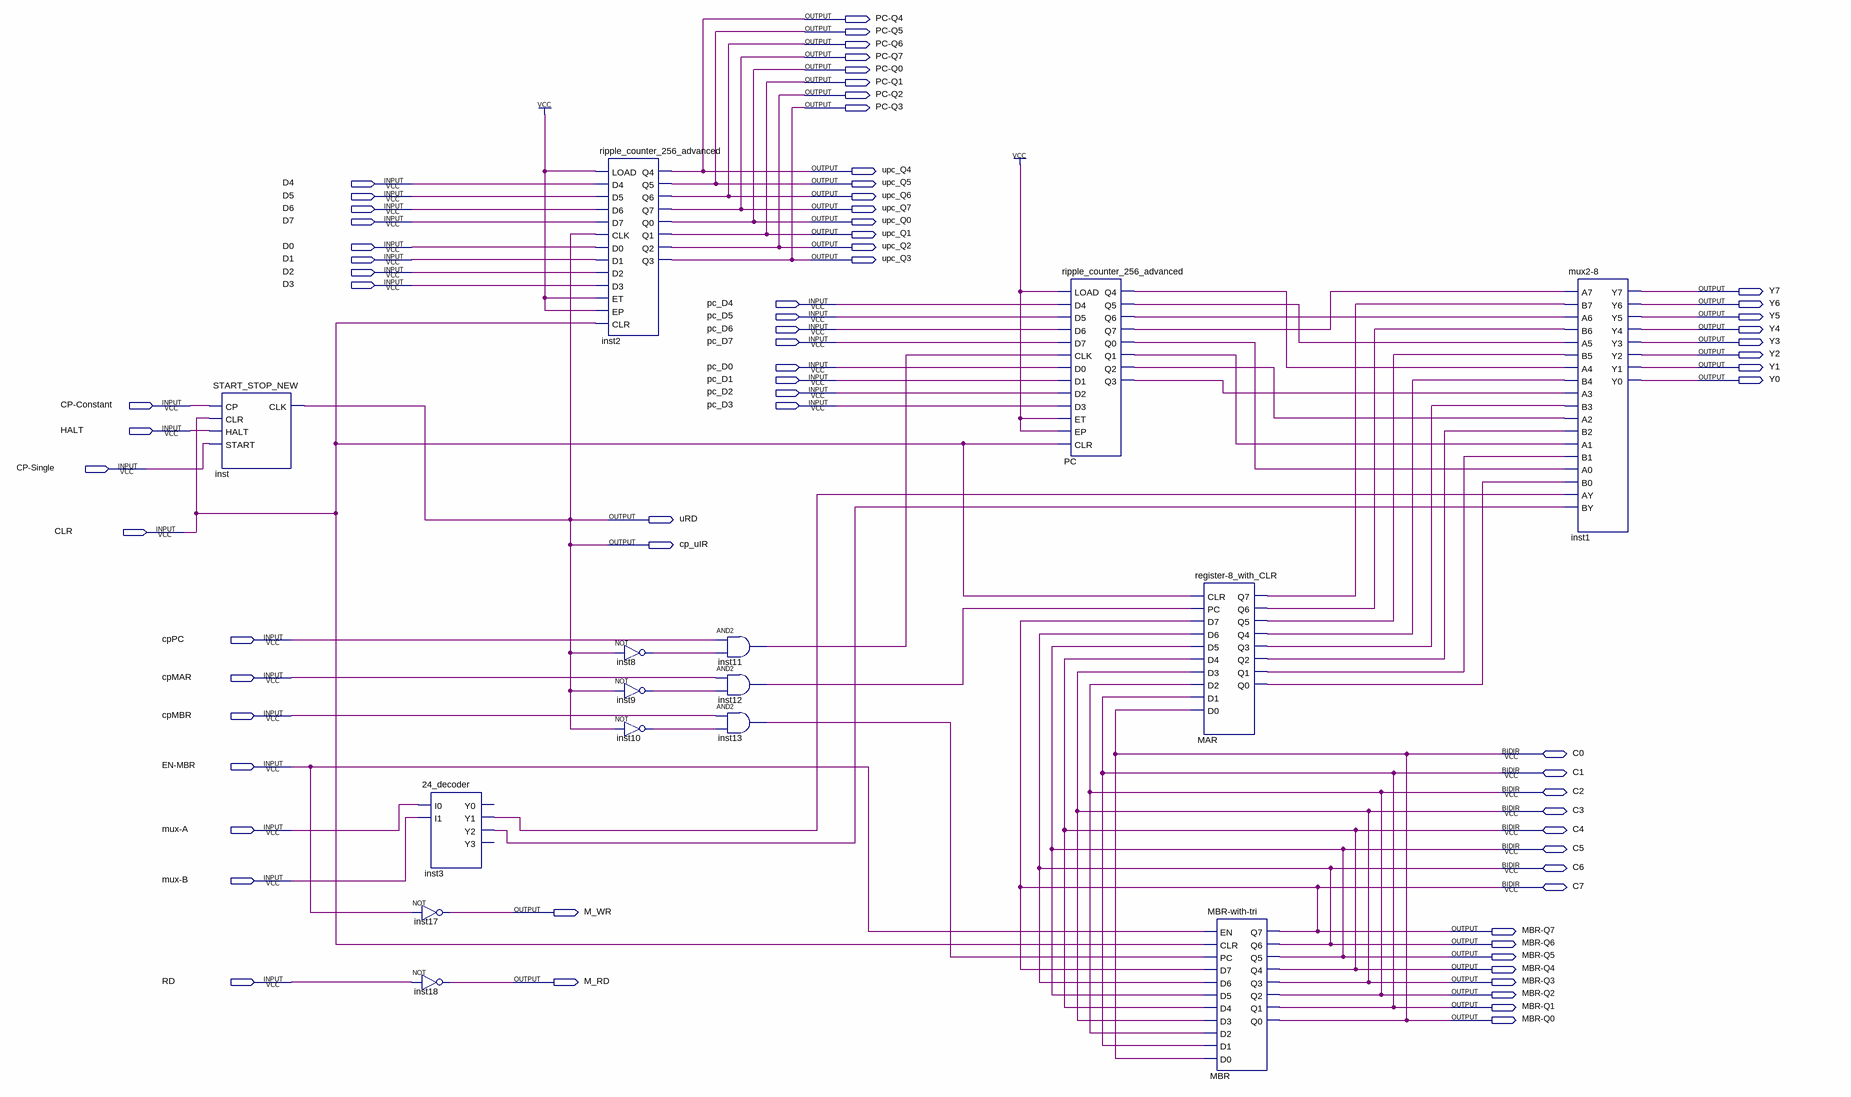
[diagram p0: schematic sheet]
// Quartus schematic microprogram-access.bdf as structural Verilog: 15 symbols, 71 pins
module \microprogram-access  (
  input  D4,
  input  D5,
  input  D6,
  input  D7,
  input  D0,
  input  D1,
  input  D2,
  input  D3,
  input  pc_D4,
  input  pc_D5,
  input  pc_D6,
  input  pc_D7,
  input  pc_D0,
  input  pc_D1,
  input  pc_D2,
  input  \CP-Constant ,
  input  pc_D3,
  input  HALT,
  input  \CP-Single ,
  input  CLR,
  input  cpPC,
  input  cpMAR,
  input  cpMBR,
  input  \EN-MBR ,
  input  \mux-A ,
  input  \mux-B ,
  input  RD,
  inout  C0,
  inout  C1,
  inout  C2,
  inout  C3,
  inout  C4,
  inout  C5,
  inout  C6,
  inout  C7,
  output \PC-Q4 ,
  output \PC-Q5 ,
  output \PC-Q6 ,
  output \PC-Q7 ,
  output \PC-Q0 ,
  output \PC-Q1 ,
  output \PC-Q2 ,
  output \PC-Q3 ,
  output upc_Q4,
  output upc_Q5,
  output upc_Q6,
  output upc_Q7,
  output upc_Q0,
  output upc_Q1,
  output upc_Q2,
  output upc_Q3,
  output Y7,
  output Y6,
  output Y5,
  output Y4,
  output Y3,
  output Y2,
  output Y1,
  output Y0,
  output uRD,
  output cp_uIR,
  output M_WR,
  output \MBR-Q7 ,
  output \MBR-Q6 ,
  output \MBR-Q5 ,
  output \MBR-Q4 ,
  output M_RD,
  output \MBR-Q3 ,
  output \MBR-Q2 ,
  output \MBR-Q1 ,
  output \MBR-Q0 
);

  wire inst3_y1, inst3_y2, inst8_out, inst9_out, inst10_out, inst11_out, inst12_out, inst13_out, MAR_q0,
       MAR_q1, MAR_q2, MAR_q3, MAR_q4, MAR_q5, MAR_q6, MAR_q7, PC_q0, PC_q1, PC_q2, PC_q3, PC_q4, PC_q5,
       PC_q6, PC_q7;

  START_STOP_NEW inst (.CP(\CP-Constant ), .CLR(CLR), .HALT(HALT), .START(\CP-Single ), .CLK(cp_uIR));
  \24_decoder  inst3 (.I0(\mux-A ), .I1(\mux-B ), .Y1(inst3_y1), .Y2(inst3_y2));  // open: Y0, Y3
  not inst17 (M_WR, \EN-MBR );
  not inst18 (M_RD, RD);
  ripple_counter_256_advanced inst2 (
    .LOAD(1'b1), .D4(D4), .D5(D5), .D6(D6), .D7(D7), .CLK(cp_uIR), .D0(D0), .D1(D1), .D2(D2), .D3(D3),
    .ET(1'b1), .EP(1'b1), .CLR(CLR), .Q4(\PC-Q4 ), .Q5(\PC-Q5 ), .Q6(\PC-Q6 ), .Q7(\PC-Q7 ), .Q0(\PC-Q0 ),
    .Q1(\PC-Q1 ), .Q2(\PC-Q2 ), .Q3(\PC-Q3 ));
  not inst8 (inst8_out, cp_uIR);
  not inst9 (inst9_out, cp_uIR);
  not inst10 (inst10_out, cp_uIR);
  and inst11 (inst11_out, cpPC, inst8_out);
  and inst12 (inst12_out, cpMAR, inst9_out);
  and inst13 (inst13_out, cpMBR, inst10_out);
  ripple_counter_256_advanced PC (
    .LOAD(1'b1), .D4(pc_D4), .D5(pc_D5), .D6(pc_D6), .D7(pc_D7), .CLK(inst11_out), .D0(pc_D0), .D1(pc_D1),
    .D2(pc_D2), .D3(pc_D3), .ET(1'b1), .EP(1'b1), .CLR(CLR), .Q4(PC_q4), .Q5(PC_q5), .Q6(PC_q6), .Q7(PC_q7),
    .Q0(PC_q0), .Q1(PC_q1), .Q2(PC_q2), .Q3(PC_q3));
  \register-8_with_CLR  MAR (
    .CLR(CLR), .PC(inst12_out), .D7(C7), .D6(C6), .D5(C5), .D4(C4), .D3(C3), .D2(C2), .D1(C1), .D0(C0),
    .Q7(MAR_q7), .Q6(MAR_q6), .Q5(MAR_q5), .Q4(MAR_q4), .Q3(MAR_q3), .Q2(MAR_q2), .Q1(MAR_q1), .Q0(MAR_q0));
  \MBR-with-tri  MBR (
    .EN(\EN-MBR ), .CLR(CLR), .PC(inst13_out), .D7(C7), .D6(C6), .D5(C5), .D4(C4), .D3(C3), .D2(C2), .D1(C1),
    .D0(C0), .Q7(C7), .Q6(C6), .Q5(C5), .Q4(C4), .Q3(C3), .Q2(C2), .Q1(C1), .Q0(C0));
  \mux2-8  inst1 (
    .A7(PC_q7), .B7(MAR_q7), .A6(PC_q6), .B6(MAR_q6), .A5(PC_q5), .B5(MAR_q5), .A4(PC_q4), .B4(MAR_q4),
    .A3(PC_q3), .B3(MAR_q3), .A2(PC_q2), .B2(MAR_q2), .A1(PC_q1), .B1(MAR_q1), .A0(PC_q0), .B0(MAR_q0),
    .AY(inst3_y1), .BY(inst3_y2), .Y7(Y7), .Y6(Y6), .Y5(Y5), .Y4(Y4), .Y3(Y3), .Y2(Y2), .Y1(Y1), .Y0(Y0));

  assign \MBR-Q0  = C0;
  assign \MBR-Q1  = C1;
  assign \MBR-Q2  = C2;
  assign \MBR-Q3  = C3;
  assign \MBR-Q4  = C4;
  assign \MBR-Q5  = C5;
  assign \MBR-Q6  = C6;
  assign \MBR-Q7  = C7;
  assign upc_Q0 = \PC-Q0 ;
  assign upc_Q1 = \PC-Q1 ;
  assign upc_Q2 = \PC-Q2 ;
  assign upc_Q3 = \PC-Q3 ;
  assign upc_Q4 = \PC-Q4 ;
  assign upc_Q5 = \PC-Q5 ;
  assign upc_Q6 = \PC-Q6 ;
  assign upc_Q7 = \PC-Q7 ;
  assign uRD = cp_uIR;
endmodule
